# Altium project simple_bezel.PrjPcb
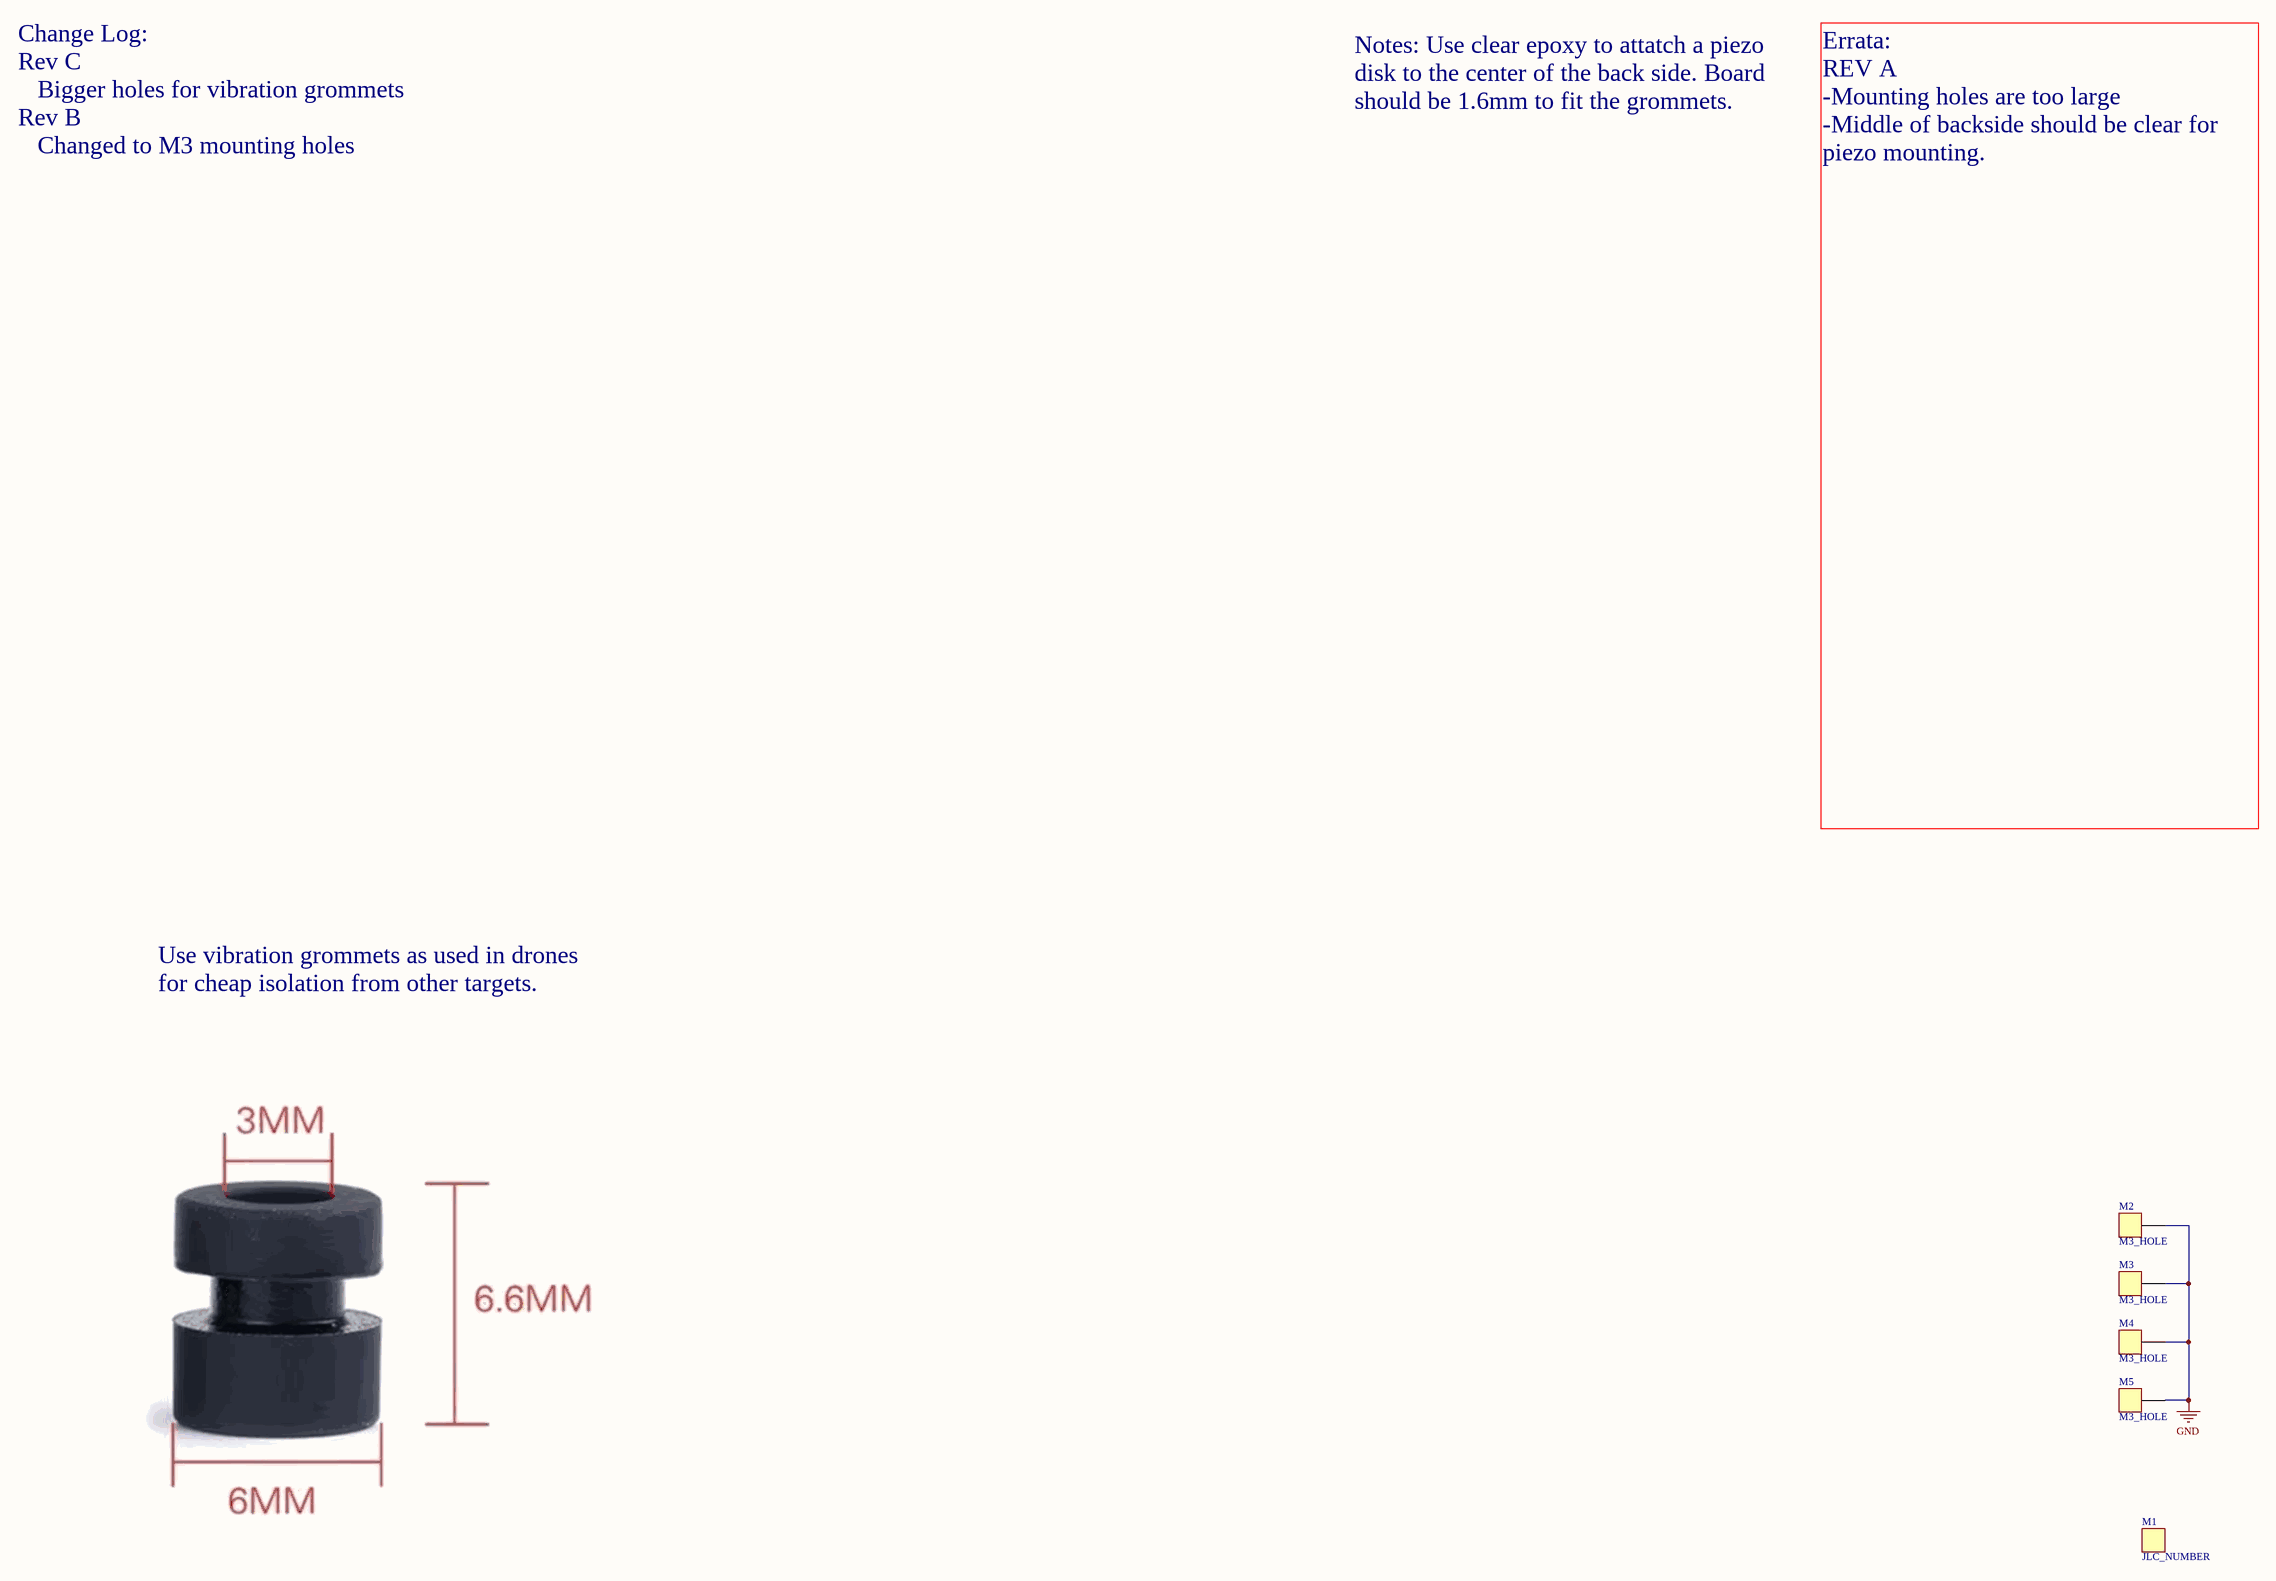
[diagram p0: simple_bezel.SchDoc]
LeadEngineer: JCF; HardRev: C; Codename: simple_bezel; BOMRev: C
1 sheet, 5 parts. Net scope: global (net labels, ports and power ports of the same name join across sheets).
Board file: simple_bezel.PcbDoc

## Sheet simple_bezel.SchDoc: Pico
size C; DocumentNumber: 1; SheetNumber: 1; SheetTotal: 1

### Parts
M1  JLC_NUMBER  [JLC_NUMBER]  (no BOM)
M2  M3_HOLE  [M3_HOLE]  (no BOM)
M3  M3_HOLE  [M3_HOLE]  (no BOM)
M4  M3_HOLE  [M3_HOLE]  (no BOM)
M5  M3_HOLE  [M3_HOLE]  (no BOM)

### Nets
GND: M2.1 M3.1 M4.1 M5.1

### Notes on the sheet
- Notes: Use clear epoxy to attatch a piezo disk to the center of the back side. Board should be 1.6mm to fit the grommets.
- Change Log:
  Rev C
  Bigger holes for vibration grommets
  Rev B
  Changed to M3 mounting holes
- Errata:
  REV A
  -Mounting holes are too large
  -Middle of backside should be clear for piezo mounting.
- Use vibration grommets as used in drones for cheap isolation from other targets.
- Title:
- This work is licensed under a Creative Commons Attribution 4.0 International License. Derivative works should remove all Sophistry branding and ‘é’ watermark.
- Date:
- Engineer:
- Revision:
- Codename:
- Time:
- Variant:
- Sheet
- of

### Library data of the parts
M1 = JLC_NUMBER: JLC Order Number Location; PartNumber: JLC_NUMBER; Manufacturer Part Number: JLC_NUMBER
M2-M5 = M3_HOLE: PartNumber: M3_HOLE; Manufacturer Part Number: M3_HOLE